# Altium project placagps.PrjPcb
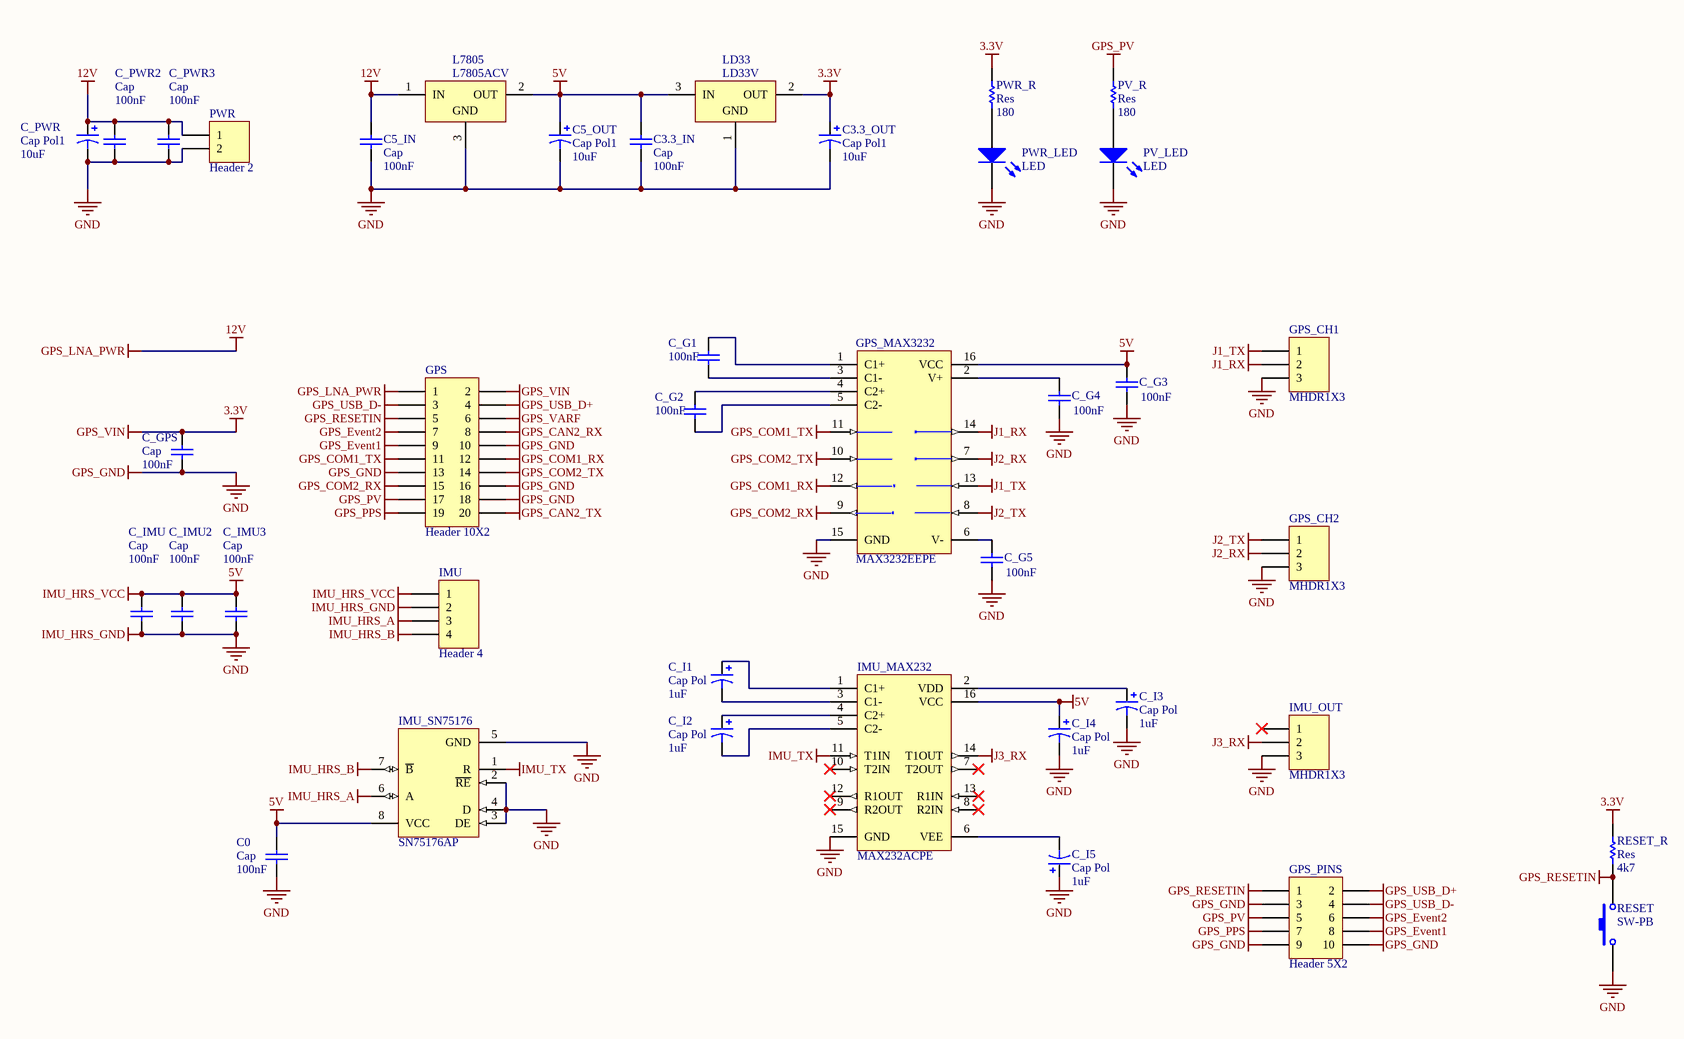
[diagram p0: schematic.SchDoc]
1 sheet, 40 parts. Net scope: global (net labels, ports and power ports of the same name join across sheets).
Board file: board.PcbDoc

## Sheet schematic.SchDoc: Placa GPS/IMU
size A3; Author: George Andrew Brindeiro; Revision: RevA1; Number: v1.0

### Parts
C0  Cap  value 100nF  [C_NANO_HOLES]
C3.3_IN  Cap  value 100nF  [C_NANO_HOLES]
C3.3_OUT  Cap Pol1  value 10uF  [B]
C5_IN  Cap  value 100nF  [C_NANO_HOLES]
C5_OUT  Cap Pol1  value 10uF  [B]
C_G1  100nF  [C_NANO_HOLES]
C_G2  100nF  [C_NANO_HOLES]
C_G3  100nF  [C_NANO_HOLES]
C_G4  100nF  [C_NANO_HOLES]
C_G5  100nF  [C_NANO_HOLES]
C_GPS  Cap  value 100nF  [C_NANO_HOLES]
C_I1  Cap Pol  value 1uF  [B]
C_I2  Cap Pol  value 1uF  [B]
C_I3  Cap Pol  value 1uF  [B]
C_I4  Cap Pol  value 1uF  [B]
C_I5  Cap Pol  value 1uF  [B]
C_IMU  Cap  value 100nF  [C_NANO_HOLES]
C_IMU2  Cap  value 100nF  [C_NANO_HOLES]
C_IMU3  Cap  value 100nF  [C_NANO_HOLES]
C_PWR  Cap Pol1  value 10uF  [B]
C_PWR2  Cap  value 100nF  [C_NANO_HOLES]
C_PWR3  Cap  value 100nF  [C_NANO_HOLES]
GPS  Header 10X2  [HDR2X10]
GPS_CH1  MHDR1X3  [HDR1X3]
GPS_CH2  MHDR1X3  [HDR1X3]
GPS_MAX3232  MAX3232EEPE  [PE16]
GPS_PINS  Header 5X2  [HDR2X5]
IMU  Header 4  [HDR1X4]
IMU_MAX232  MAX232ACPE  [PE16A]
IMU_OUT  MHDR1X3  [HDR1X3]
IMU_SN75176  SN75176AP  [P008]
L7805  L7805ACV  [TO220ABN]
LD33  LD33V  [T03B]
PV_LED  LED  [B]
PV_R  Res  value 180  [AXIAL-0.3]
PWR  Header 2  [HDR1X2]
PWR_LED  LED  [B]
PWR_R  Res  value 180  [AXIAL-0.3]
RESET  SW-PB  [PUSHBUTTON]
RESET_R  Res  value 4k7  [AXIAL-0.3]

### Nets
3.3V: C3.3_OUT.1 C_GPS.2 GPS.2 LD33.2(OUT) PWR_R.2 RESET_R.2  [also labelled GPS_VIN]
5V: C0.2 C3.3_IN.1 C5_OUT.1 C_G3.2 C_I4.1 C_IMU.2 C_IMU2.2 C_IMU3.2 GPS_MAX3232.16(VCC) IMU.1 IMU_MAX232.16(VCC) IMU_SN75176.8(VCC) L7805.2(OUT) LD33.3(IN)  [also labelled IMU_HRS_VCC]
12V: C5_IN.1 C_PWR.1 C_PWR2.2 C_PWR3.2 GPS.1 L7805.1(IN) PWR.1  [also labelled GPS_LNA_PWR]
GND: C0.1 C3.3_IN.2 C3.3_OUT.2 C5_IN.2 C5_OUT.2 C_G3.1 C_G4.1 C_G5.1 C_GPS.1 C_I3.2 C_I4.2 C_I5.1 C_IMU.1 C_IMU2.1 C_IMU3.1 C_PWR.2 C_PWR2.1 C_PWR3.1 GPS.10 GPS.13 GPS.16 GPS.18 GPS_CH1.3 GPS_CH2.3 GPS_MAX3232.15(GND) GPS_PINS.3 GPS_PINS.9 GPS_PINS.10 IMU.2 IMU_MAX232.15(GND) IMU_OUT.3 IMU_SN75176.2(~{RE}) IMU_SN75176.3(DE) IMU_SN75176.4(D) IMU_SN75176.5(GND) L7805.3(GND) LD33.1(GND) PV_LED.2(K) PWR.2 PWR_LED.2(K) RESET.1  [also labelled GPS_GND, IMU_HRS_GND]
GPS_CAN2_RX: GPS.8
GPS_CAN2_TX: GPS.20
GPS_COM1_RX: GPS.12 GPS_MAX3232.12(R1OUT)
GPS_COM1_TX: GPS.11 GPS_MAX3232.11(T1IN)
GPS_COM2_RX: GPS.15 GPS_MAX3232.9(R2OUT)
GPS_COM2_TX: GPS.14 GPS_MAX3232.10(T2IN)
GPS_Event1: GPS.9 GPS_PINS.8
GPS_Event2: GPS.7 GPS_PINS.6
GPS_PPS: GPS.19 GPS_PINS.7
GPS_PV: GPS.17 GPS_PINS.5 PV_R.2
GPS_RESETIN: GPS.5 GPS_PINS.1 RESET.2 RESET_R.1
GPS_USB_D+: GPS.4 GPS_PINS.2
GPS_USB_D-: GPS.3 GPS_PINS.4
GPS_VARF: GPS.6
IMU_HRS_A: IMU.3 IMU_SN75176.6(A)
IMU_HRS_B: IMU.4 IMU_SN75176.7(~{B})
IMU_TX: IMU_MAX232.11(T1IN) IMU_SN75176.1(R)
J1_RX: GPS_CH1.2 GPS_MAX3232.14(T1OUT)
J1_TX: GPS_CH1.1 GPS_MAX3232.13(R1IN)
J2_RX: GPS_CH2.2 GPS_MAX3232.7(T2OUT)
J2_TX: GPS_CH2.1 GPS_MAX3232.8(R2IN)
J3_RX: IMU_MAX232.14(T1OUT) IMU_OUT.2
NetC_G1_1: C_G1.1 GPS_MAX3232.3(C1-)
NetC_G1_2: C_G1.2 GPS_MAX3232.1(C1+)
NetC_G2_1: C_G2.1 GPS_MAX3232.5(C2-)
NetC_G2_2: C_G2.2 GPS_MAX3232.4(C2+)
NetC_G4_2: C_G4.2 GPS_MAX3232.2(V+)
NetC_G5_2: C_G5.2 GPS_MAX3232.6(V-)
NetC_I1_1: C_I1.1 IMU_MAX232.1(C1+)
NetC_I1_2: C_I1.2 IMU_MAX232.3(C1-)
NetC_I2_1: C_I2.1 IMU_MAX232.4(C2+)
NetC_I2_2: C_I2.2 IMU_MAX232.5(C2-)
NetC_I3_1: C_I3.1 IMU_MAX232.2(VDD)
NetC_I5_2: C_I5.2 IMU_MAX232.6(VEE)
NetPV_LED_1: PV_LED.1(A) PV_R.1
NetPWR_LED_1: PWR_LED.1(A) PWR_R.1

Not connected (* = marked no-connect by the designer): IMU_MAX232 7(T2OUT)* 8(R2IN)* 9(R2OUT)* 10(T2IN)* 12(R1OUT)* 13(R1IN)*; IMU_OUT 1*

### Library data of the parts
C0 C3.3_IN C5_IN C_G1-C_G5 C_GPS C_IMU C_IMU2 C_IMU3 C_PWR2 C_PWR3 = Cap: Capacitor; Published: 8-Jun-2000; LatestRevisionDate: 17-Jul-2002; LatestRevisionNote: Re-released for DXP Platform.; PackageReference: RAD-0.3; Publisher: Altium Limited
  C_G1-C_G5: Value: 100nF
C3.3_OUT C5_OUT C_I1-C_I5 C_PWR = Cap Pol1: Polarized Capacitor (Radial); Published: 8-Jun-2000; LatestRevisionDate: 17-Jul-2002; LatestRevisionNote: Re-released for DXP Platform.; PackageReference: RB7.6-15; Publisher: Altium Limited
GPS = Header 10X2: Header, 10-Pin, Dual row; LatestRevisionDate: 17-Jul-2002; LatestRevisionNote: Re-released for DXP Platform.; Publisher: Altium Limited
GPS_CH1 GPS_CH2 IMU_OUT = MHDR1X3: Header, 3-Pin; LatestRevisionDate: 17-Jul-2002; LatestRevisionNote: Re-released for DXP Platform.; Publisher: Altium Limited
GPS_MAX3232 = MAX3232EEPE: ±15kV ESD-Protected, 3.0V to 5.5V, Low-Power, up to 250kbps, True RS-232 Transceiver; Published: 16-Jan-2001; LatestRevisionDate: 06-Jun-2005; LatestRevisionNote: Stylized 3D Model Added.; DatasheetVersion: Mar-1999; PackageVersion: Aug-2000; PackageReference: PE16; Publisher: Altium Limited; PackageDescription: DIP; 16 Leads; Row Spacing 7.62 mm; Pitch 2.54 mm; Code_JEDEC: MS-001-BB; ComponentLink1Description: Manufacturer Link; ComponentLink1URL: http://www.maxim-ic.com/; ComponentLink2Description: Datasheet; ComponentLink2URL: http://pdfserv.maxim-ic.com/en/ds/MAX3222E-MAX3246E.pdf
GPS_PINS = Header 5X2: Header, 5-Pin, Dual row; LatestRevisionDate: 17-Jul-2002; LatestRevisionNote: Re-released for DXP Platform.; Publisher: Altium Limited
IMU = Header 4: Header, 4-Pin; LatestRevisionDate: 17-Jul-2002; LatestRevisionNote: Re-released for DXP Platform.; Publisher: Altium Limited
IMU_MAX232 = MAX232ACPE: +5V Powered, Multi-Channel RS-232 Driver/Receiver; Published: 16-Jan-2001; LatestRevisionDate: 06-Jun-2005; LatestRevisionNote: Stylized 3D Model Added.; PackageVersion: 1997; PackageReference: PE16A; Publisher: Altium Limited; PackageDescription: DIP; 16 Leads; Row Spacing 7.62 mm; Pitch 2.54 mm; Code_JEDEC: MS-001-BB; ComponentLink1Description: Manufacturer Link; ComponentLink1URL: http://www.maxim-ic.com/; ComponentLink2Description: Datasheet; ComponentLink2URL: http://pdfserv.maxim-ic.com/en/ds/MAX220-MAX249.pdf
IMU_SN75176 = SN75176AP: Differential Bus Transceiver; Note: Receiver Hysteresis of 50mV Typical; Published: 15-May-2002; LatestRevisionDate: 04-Mar-2005; LatestRevisionNote: Stylized 3D Model Added.; DatasheetVersion: Aug-1989; PackageVersion: Jun-1999; PackageReference: P008; Publisher: Altium Limited; PackageDescription: DIP; 8 Leads; Row Spacing 7.62 mm; Pitch 2.54 mm; Code_JEDEC: MO-001-AN; ComponentLink1Description: Manufacturer Link; ComponentLink1URL: http://www.ti.com/; ComponentLink2Description: Datasheet; ComponentLink2URL: http://www-s.ti.com/sc/ds/sn75176a.pdf
L7805 = L7805ACV: Precision 1A Regulator; Note: Tab is connected to pin 3 (GND).; Published: 24-Aug-2001; LatestRevisionDate: 17-Jul-2002; LatestRevisionNote: Re-released for DXP Platform.; DatasheetVersion: Nov-1999; PackageVersion: Jun-1998; PackageReference: TO220ABN; Publisher: Altium Limited; PackageDescription: TO, Thru-Hole, Vertical, Heatsink Mounted; 3 In-Line Leads; Pitch 2.54 mm; Pin sequence 1, 3, 2; ComponentLink1Description: Manufacturer Link; ComponentLink1URL: http://www.st.com/; ComponentLink2Description: Datasheet; ComponentLink2URL: http://www.st.com/stonline/products/literature/ds/2144/l7805ab.pdf
LD33 = LM1117T-3.3: 800mA Low-Dropout Linear Regulator; Manufacturer: National Semiconductor; CompType: LDO IC; PackageTopMarking: NSUZXYTTE#*LM1117T*3.3; Published: 4-Dec-2008; DatasheetVersion: Apr-2006; PackageVersion: revL, Jan-1992; PackageReference: T03B; Publisher: Altium Limited; PackageDescription: TO-220, Molded, 3 Lead, Straight; PartNumber: LM1117T-3.3; RoHS: O; PinCount: 3; DigiKeyPartNumber: LM1117T-3.3-ND; ComponentLink1Description: LM1117 Datasheet; ComponentLink1URL: http://www.national.com/ds/LM/LM1117.pdf; ComponentLink2Description: LM1117 Web Page; ComponentLink2URL: http://www.national.com/pf/LM/LM1117.html; ComponentLink3Description: T03B Package Page; ComponentLink3URL: http://www.national.com/packaging/folders/t03b.html
PV_LED PWR_LED = LED0: Typical INFRARED GaAs LED; Published: 8-Jun-2000; LatestRevisionDate: 08-Jul-2005; LatestRevisionNote: Mech Layer 1 removed.; PackageReference: LED-0; Publisher: Altium Limited
PV_R PWR_R RESET_R = Res1: Resistor; Published: 8-Jun-2000; LatestRevisionDate: 17-Jul-2002; LatestRevisionNote: Re-released for DXP Platform.; PackageReference: AXIAL-0.3; Publisher: Altium Limited
PWR = Header 2: Header, 2-Pin; LatestRevisionDate: 17-Jul-2002; LatestRevisionNote: Re-released for DXP Platform.; Publisher: Altium Limited
RESET = SW-PB: Switch; Published: 24-Mar-1999; LatestRevisionDate: 17-Jul-2002; LatestRevisionNote: Re-released for DXP Platform.; PackageReference: SPST-2; Publisher: Altium Limited